# Altium schematic sheet LastProject.SchDoc
size A; SheetNumber: 2; SheetTotal: 2
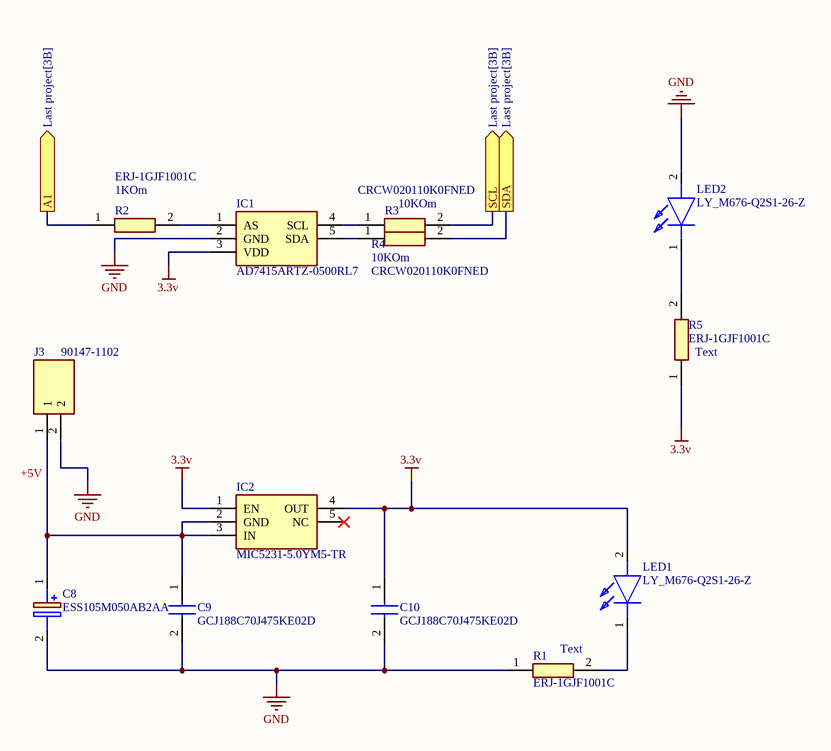
[diagram p0: LastProject.SchDoc]

## Parts
C8  ESS105M050AB2AA  [CAPPRD150W45D400H850]
C9  GCJ188C70J475KE02D  [CAPC1608X100N]
C10  GCJ188C70J475KE02D  [CAPC1608X100N]
IC1  AD7415ARTZ-0500RL7  [SOT95P280X145-5N]
IC2  MIC5231-5.0YM5-TR  [SOT95P280X145-5N]
J3  90147-1102  [RHDR2W70P0X254_1X2_493X244X870P]
LED1  LY_M676-Q2S1-26-Z  [LYM676Q2S126Z]
LED2  LY_M676-Q2S1-26-Z  [LYM676Q2S126Z]
R1  ERJ-1GJF1001C  [ERJ1GJJ2R4C]
R2  ERJ-1GJF1001C  [ERJ1GJJ2R4C]
R3  CRCW020110K0FNED  [RESC0603X28N]
R4  CRCW020110K0FNED  [RESC0603X28N]
R5  ERJ-1GJF1001C  [ERJ1GJJ2R4C]

## Ports
A1 (out, see Last project[3B]), SCL (out, see Last project[3B]), SDA (out, see Last project[3B])

## Nets
3.3v: C10.1 IC1.3(VDD) IC2.1(EN) IC2.4(OUT) LED1.2(A) R5.1
GND: C8.2(-) C9.2 C10.2 IC1.2(GND) J3.2 LED2.2(A) R1.1
A1: R2.1 ; port A1
SCL: R3.2 ; port SCL
SDA: R4.2 ; port SDA
NetC8_1: C8.1(+) C9.1 IC2.2(GND) IC2.3(IN) J3.1
NetIC1_1: IC1.1(AS) R2.2
NetIC1_4: IC1.4(SCL) R3.1
NetIC1_5: IC1.5(SDA) R4.1
NetLED1_1: LED1.1(K) R1.2
NetLED2_1: LED2.1(K) R5.2

Not connected (* = marked no-connect by the designer): IC2 5(NC)*

## Notes on the sheet
- (near R2) 1KOm
- (near R3) 10KOm
- (near R4) 10KOm
- (near R5) Text
- (near R1) Text
- Labels drawn without touching a wire or pin: +5V

## Library data of the parts
C8 = ESS105M050AB2AA: Capacitor Polarised; Manufacturer_Name: KEMET; Datasheet Link: https://content.kemet.com/datasheets/KEM_A4057_ESS.pdf; Height: 8.5mm; Manufacturer_Part_Number: ESS105M050AB2AA; Mouser Part Number: 80-ESS105M050AB2AA; Mouser Price/Stock: https://www.mouser.co.uk/ProductDetail/KEMET/ESS105M050AB2AA?qs=gt1LBUVyoHk47Kt2aLnHUQ%3D%3D
C9 C10 = GCJ188C70J475KE02D: Capacitor; Manufacturer_Name: Murata Electronics; Datasheet Link: https://psearch.en.murata.com/capacitor/product/GCJ188C70J475KE02%23.html; Height: 1mm; Manufacturer_Part_Number: GCJ188C70J475KE02D; Mouser Part Number: 81-GCJ188C70J475KE2D; Mouser Price/Stock: https://www.mouser.co.uk/ProductDetail/Murata-Electronics/GCJ188C70J475KE02D?qs=QzBtWTOodeVfJR8CElrI4A%3D%3D; Arrow Part Number: GCJ188C70J475KE02D; Arrow Price/Stock: https://www.arrow.com/en/products/gcj188c70j475ke02d/murata-manufacturing?region=nac
IC1 = AD7415ARTZ-0500RL7: Integrated Circuit; Manufacturer_Name: Analog Devices; Datasheet Link: https://www.analog.com/AD7415/datasheet; Height: 1.45mm; Manufacturer_Part_Number: AD7415ARTZ-0500RL7; Mouser Part Number: 584-AD7415ARTZ0500R7; Mouser Price/Stock: https://www.mouser.co.uk/ProductDetail/Analog-Devices/AD7415ARTZ-0500RL7?qs=NmRFExCfTkFziIEXjMqLhQ%3D%3D; Arrow Part Number: AD7415ARTZ-0500RL7; Arrow Price/Stock: https://www.arrow.com/en/products/ad7415artz-0500rl7/analog-devices?region=nac
IC2 = MIC5231-5.0YM5-TR: Integrated Circuit; Manufacturer_Name: Microchip; Datasheet Link: http://www.microchip.com/mymicrochip/filehandler.aspx?ddocname=en579721; Height: 1.45mm; Manufacturer_Part_Number: MIC5231-5.0YM5-TR; Mouser Part Number: 998-MIC5231-5.0YM5TR; Mouser Price/Stock: https://www.mouser.co.uk/ProductDetail/Microchip-Technology-Atmel/MIC5231-5.0YM5-TR?qs=U6T8BxXiZAXU7aRj5PQ2zw%3D%3D; Arrow Part Number: MIC5231-5.0YM5-TR; Arrow Price/Stock: https://www.arrow.com/en/products/mic5231-5.0ym5-tr/microchip-technology?region=nac
J3 = 90147-1102: Connector; Manufacturer_Name: Molex; Datasheet Link: https://componentsearchengine.com/Datasheets/1/90147-1102.pdf; Height: 8.7mm; Manufacturer_Part_Number: 90147-1102; Mouser Part Number: 538-90147-1102; Mouser Price/Stock: https://www.mouser.co.uk/ProductDetail/Molex/90147-1102?qs=QESXi79X%252BKphYEszDmsGRw%3D%3D
LED1 LED2 = LY_M676-Q2S1-26-Z: LED; Manufacturer_Name: ams OSRAM; Manufacturer_Part_Number: LY M676-Q2S1-26-Z; Datasheet Link: https://www.mouser.com/datasheet/2/588/Osram_7222021_LY__M676_EN-2891431.pdf; Height: 1.4mm; Mouser Part Number: 720-LYM676Q2S126Z; Mouser Price/Stock: https://www.mouser.co.uk/ProductDetail/ams-OSRAM/LY-M676-Q2S1-26-Z?qs=nTDll3UaDK64U7BuhoNaqQ%3D%3D
R1 R2 R5 = ERJ-1GJF1001C: Resistor; Manufacturer_Name: Panasonic; Datasheet Link: https://industrial.panasonic.com/cdbs/www-data/pdf/RDA0000/AOA0000C304.pdf; Height: 0.26mm; Manufacturer_Part_Number: ERJ-1GJF1001C; Mouser Part Number: 667-ERJ-1GJF1001C; Mouser Price/Stock: https://www.mouser.co.uk/ProductDetail/Panasonic/ERJ-1GJF1001C?qs=OcgtsXO%252B3guJUjvXwXq4eA%3D%3D; Arrow Part Number: ERJ-1GJF1001C; Arrow Price/Stock: https://www.arrow.com/en/products/erj-1gjf1001c/panasonic?region=nac
R3 R4 = CRCW020110K0FNED: Resistor; Manufacturer_Name: Vishay; Datasheet Link: http://www.vishay.com/docs/20035/dcrcwe3.pdf; Height: 0.28mm; Manufacturer_Part_Number: CRCW020110K0FNED; Mouser Part Number: 71-CRCW0201-10K; Mouser Price/Stock: https://www.mouser.co.uk/ProductDetail/Vishay-Dale/CRCW020110K0FNED?qs=IQLUlsvFoXuh7T4rhkKYcQ%3D%3D; Arrow Part Number: CRCW020110K0FNED; Arrow Price/Stock: https://www.arrow.com/en/products/crcw020110k0fned/vishay?region=nac